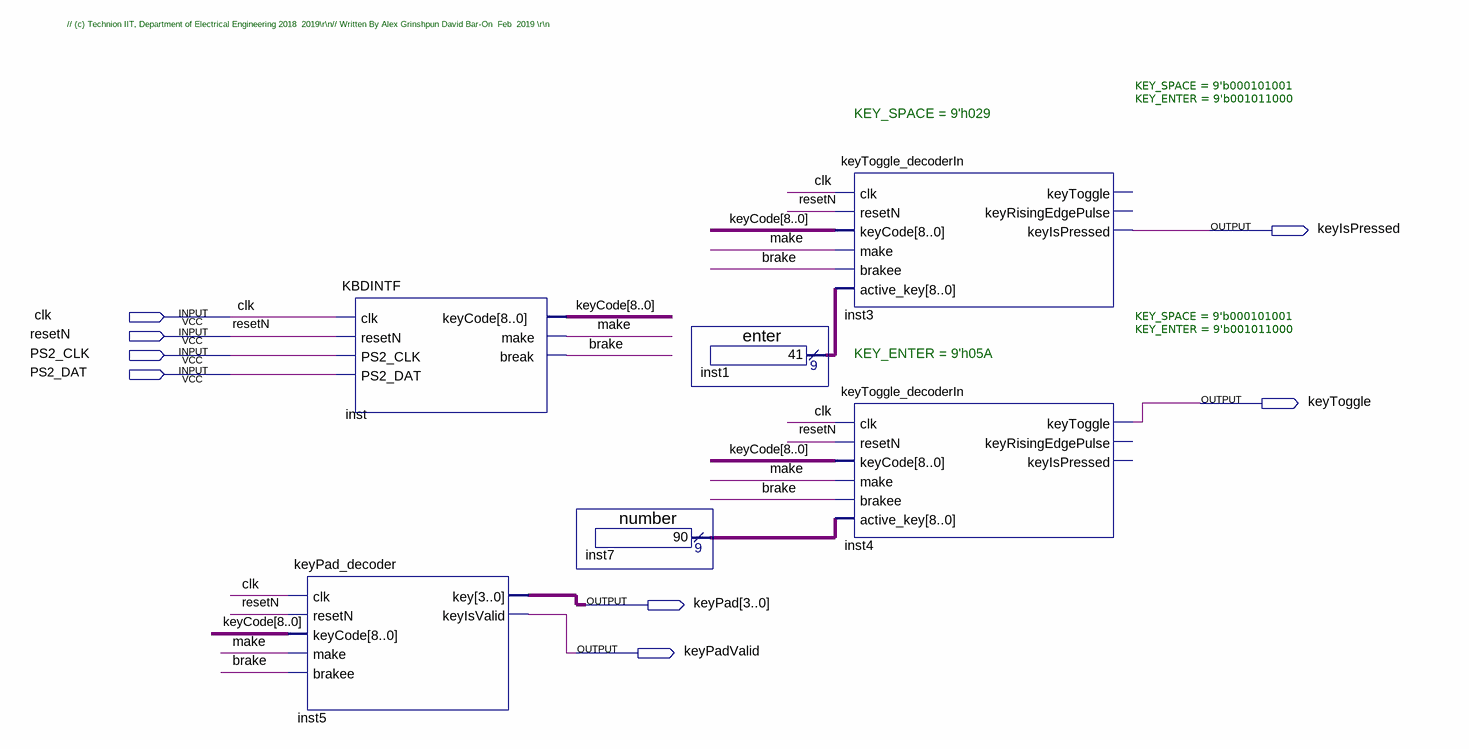
[diagram p0: schematic sheet]
// Quartus schematic TOP_KBD_DEMO.bdf as structural Verilog: 6 symbols, 8 pins
module TOP_KBD_DEMO (
  input  clk,
  input  resetN,
  input  PS2_CLK,
  input  PS2_DAT,
  output keyIsPressed,
  output keyToggle,
  output [3:0] keyPad,
  output keyPadValid
);

  wire brake, make;
  wire [8:0] inst1_result, inst7_result, keyCode;

  KBDINTF inst (
    .clk(clk), .resetN(resetN), .PS2_CLK(PS2_CLK), .PS2_DAT(PS2_DAT), .keyCode(keyCode), .make(make),
    .\break (brake));
  keyPad_decoder inst5 (
    .clk(clk), .resetN(resetN), .keyCode(keyCode), .make(make), .brakee(brake), .key(keyPad),
    .keyIsValid(keyPadValid));
  number inst7 (.result(inst7_result));
  enter inst1 (.result(inst1_result));
  keyToggle_decoderIn #(.KEY_SPACE(9'b000101001), .KEY_ENTER(9'b001011000)) inst3 (
    .clk(clk), .resetN(resetN), .keyCode(keyCode), .make(make), .brakee(brake), .active_key(inst1_result),
    .keyIsPressed(keyIsPressed));  // open: keyToggle, keyRisingEdgePulse
  keyToggle_decoderIn #(.KEY_SPACE(9'b000101001), .KEY_ENTER(9'b001011000)) inst4 (
    .clk(clk), .resetN(resetN), .keyCode(keyCode), .make(make), .brakee(brake), .active_key(inst7_result),
    .keyToggle(keyToggle));  // open: keyRisingEdgePulse, keyIsPressed

  // Notes on the sheet:
  //   // (c) Technion IIT, Department of Electrical Engineering 2018  2019\r\n// Written By Alex Grinshpun David Bar-On  Feb  2019 \r\n
  //   KEY_SPACE = 9'h029
  //   KEY_ENTER = 9'h05A
endmodule
